# Altium schematic sheet dac.SchDoc: 基于dac0832的数模转换电路
size A4; DrawnBy: Athurg; DocumentNumber: 1; Revision: 1; SheetNumber: 1
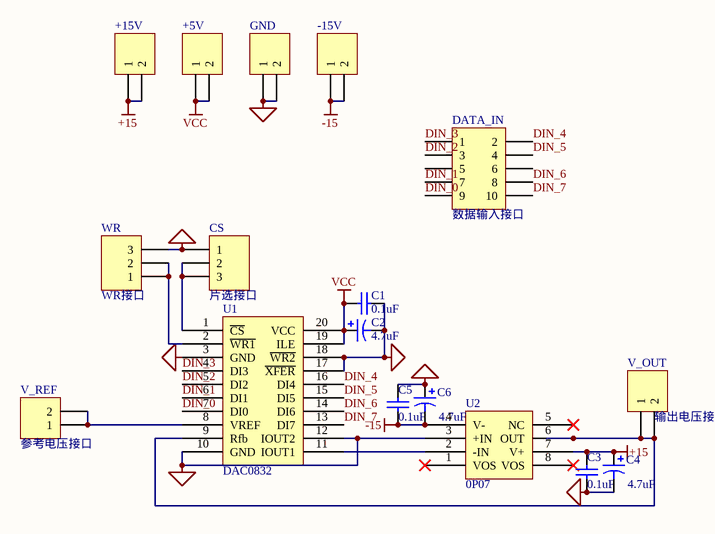
[diagram p0: dac.SchDoc]

## Parts
+5V  +5V  [HDR1X2]  (value not drawn)
+15V  +15V  [HDR1X2]  (value not drawn)
-15V  -15V  [HDR1X2]  (value not drawn)
C1  value 0.1uF  [C0805]  (hidden comment: Cap)
C2  value 4.7uF  [C1206]  (hidden comment: Cap Pol1)
C3  value 0.1uF  [C0805]  (hidden comment: Cap)
C4  value 4.7uF  [C1206]  (hidden comment: Cap Pol1)
C5  value 0.1uF  [C0805]  (hidden comment: Cap)
C6  value 4.7uF  [C1206]  (hidden comment: Cap Pol1)
CS  片选接口  [HDR1X3]
DATA_IN  数据输入接口  [HDR2X5]
GND  GND  [HDR1X2]  (value not drawn)
U1  DAC0832  [DIP-20]
U2  0P07  [DIP-8]
V_OUT  输出电压接口  [HDR1X2]
V_REF  参考电压接口  [HDR1X2]
WR  WR接口  [HDR1X3]

## Nets
+15: +15V.1 +15V.2 C3.2 C4.1 U2.7(V+)
-15: -15V.1 -15V.2 C5.1 C6.2 U2.4(V-)
GND: C1.2 C2.2 C3.1 C4.2 C5.2 C6.1 CS.1 GND.1 GND.2 U1.3(GND) U1.10(GND) U1.12(IOUT2) U1.17(~{XFER}) U1.18(~{WR2}) U2.3(+IN) WR.3
VCC: +5V.1 +5V.2 C1.1 C2.1 U1.19(ILE) U1.20(VCC)
DIN_0: DATA_IN.9 U1.7(DI0)
DIN_1: DATA_IN.7 U1.6(DI1)
DIN_2: DATA_IN.3 U1.5(DI2)
DIN_3: DATA_IN.1 U1.4(DI3)
DIN_4: DATA_IN.2 U1.16(DI4)
DIN_5: DATA_IN.4 U1.15(DI5)
DIN_6: DATA_IN.8 U1.14(DI6)
DIN_7: DATA_IN.10 U1.13(DI7)
NetCS_2: CS.2 CS.3 U1.1(~{CS})
NetU1_2: U1.2(~{WR1}) WR.1 WR.2
NetU1_8: U1.8(VREF) V_REF.1 V_REF.2
NetU1_9: U1.9(Rfb) U2.6(OUT) V_OUT.1 V_OUT.2
NetU1_11: U1.11(IOUT1) U2.2(-IN)

Not connected (* = marked no-connect by the designer): DATA_IN 5 6; U2 1(VOS)* 5(NC)* 8(VOS)*

## Library data of the parts
+5V +15V -15V GND V_OUT V_REF = Header 2H: Header, 2-Pin, Right Angle; LatestRevisionDate: 17-Jul-2002; LatestRevisionNote: Re-released for DXP Platform.; Publisher: Altium Limited
C1 C3 C5 = Cap: Capacitor; Published: 8-Jun-2000; LatestRevisionDate: 17-Jul-2002; LatestRevisionNote: Re-released for DXP Platform.; PackageReference: RAD-0.3; Publisher: Altium Limited
C2 C4 C6 = Cap Pol1: Polarized Capacitor (Radial); Published: 8-Jun-2000; LatestRevisionDate: 17-Jul-2002; LatestRevisionNote: Re-released for DXP Platform.; PackageReference: RB7.6-15; Publisher: Altium Limited
CS WR = Header 3H: Header, 3-Pin, Right Angle; LatestRevisionDate: 17-Jul-2002; LatestRevisionNote: Re-released for DXP Platform.; Publisher: Altium Limited
DATA_IN = Header 5X2: Header, 5-Pin, Dual row; LatestRevisionDate: 17-Jul-2002; LatestRevisionNote: Re-released for DXP Platform.; Publisher: Altium Limited
U2 = OP07